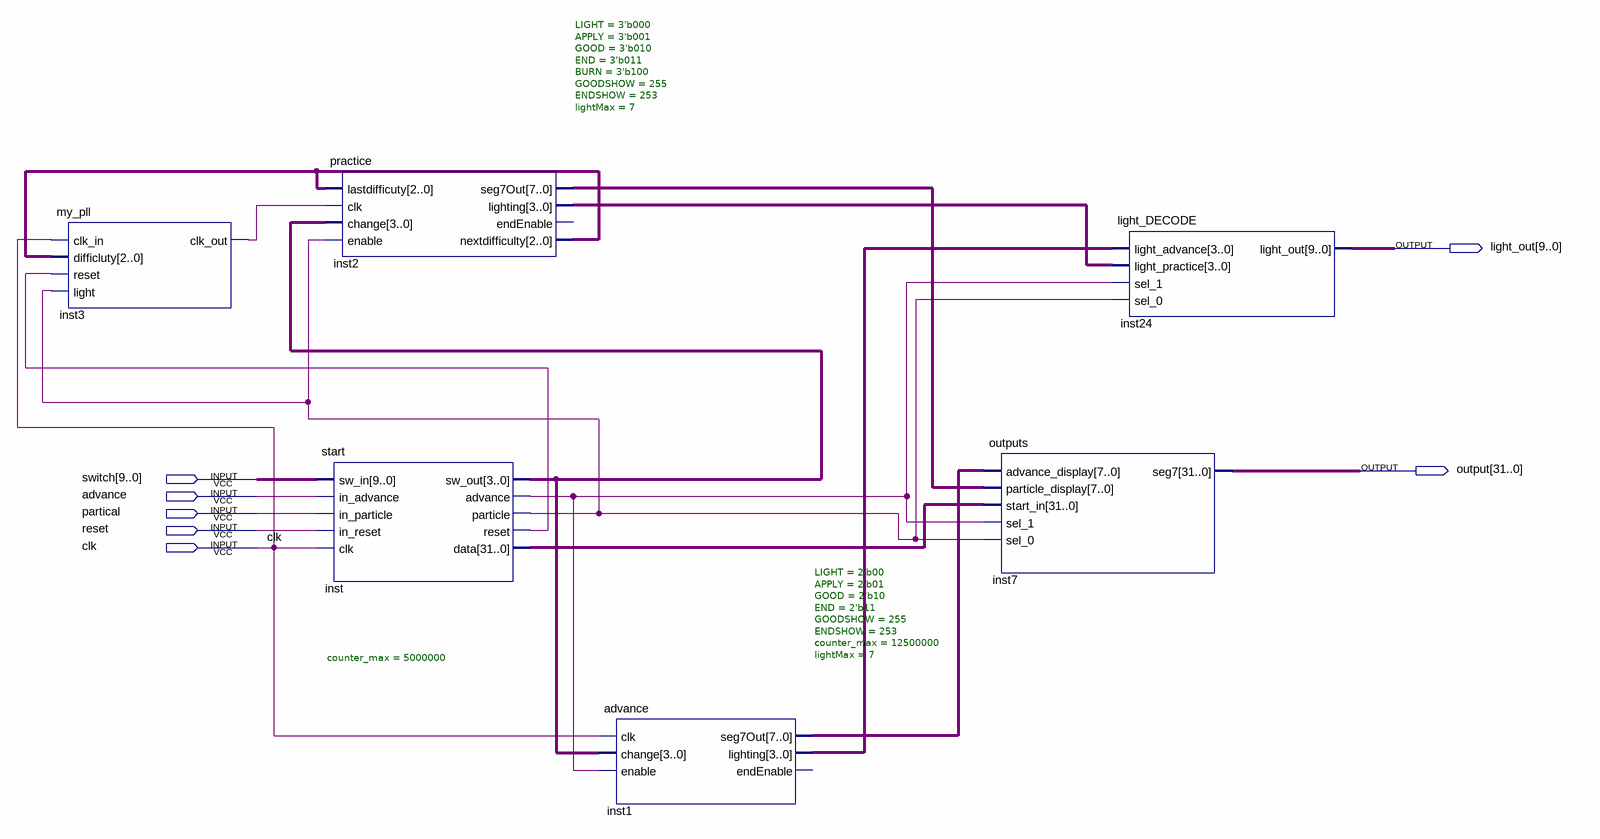
[diagram p0: schematic sheet]
// Quartus schematic FINAL.bdf as structural Verilog: 6 symbols, 7 pins
module FINAL (
  input  [9:0] switch,
  input  advance,
  input  partical,
  input  reset,
  input  clk,
  output [9:0] light_out,
  output [31:0] \output 
);

  wire inst3_clk_out, inst_advance, inst_particle, inst_reset;
  wire [2:0] inst2_nextdifficulty;
  wire [3:0] inst1_lighting, inst2_lighting, inst_sw_out;
  wire [7:0] inst1_seg7out, inst2_seg7out;
  wire [31:0] inst_data;

  my_pll inst3 (
    .clk_in(clk), .difficluty(inst2_nextdifficulty), .reset(inst_reset), .light(inst_particle),
    .clk_out(inst3_clk_out));
  start #(.counter_max(5000000)) inst (
    .sw_in(switch), .in_advance(advance), .in_particle(partical), .in_reset(reset), .clk(clk),
    .sw_out(inst_sw_out), .advance(inst_advance), .particle(inst_particle), .reset(inst_reset),
    .data(inst_data));
  practice #(.LIGHT(3'b000), .APPLY(3'b001), .GOOD(3'b010), .END(3'b011), .BURN(3'b100), .GOODSHOW(255), .ENDSHOW(253), .lightMax(7)) inst2 (
    .lastdifficuty(inst2_nextdifficulty), .clk(inst3_clk_out), .change(inst_sw_out), .enable(inst_particle),
    .seg7Out(inst2_seg7out), .lighting(inst2_lighting), .nextdifficulty(inst2_nextdifficulty));  // open: endEnable
  advance #(.LIGHT(2'b00), .APPLY(2'b01), .GOOD(2'b10), .END(2'b11), .GOODSHOW(255), .ENDSHOW(253), .counter_max(12500000), .lightMax(7)) inst1 (
    .clk(clk), .change(inst_sw_out), .enable(inst_advance), .seg7Out(inst1_seg7out), .lighting(inst1_lighting));  // open: endEnable
  outputs inst7 (
    .advance_display(inst1_seg7out), .particle_display(inst2_seg7out), .start_in(inst_data),
    .sel_1(inst_advance), .sel_0(inst_particle), .seg7(\output ));
  light_DECODE inst24 (
    .light_advance(inst1_lighting), .light_practice(inst2_lighting), .sel_1(inst_advance),
    .sel_0(inst_particle), .light_out(light_out));
endmodule
